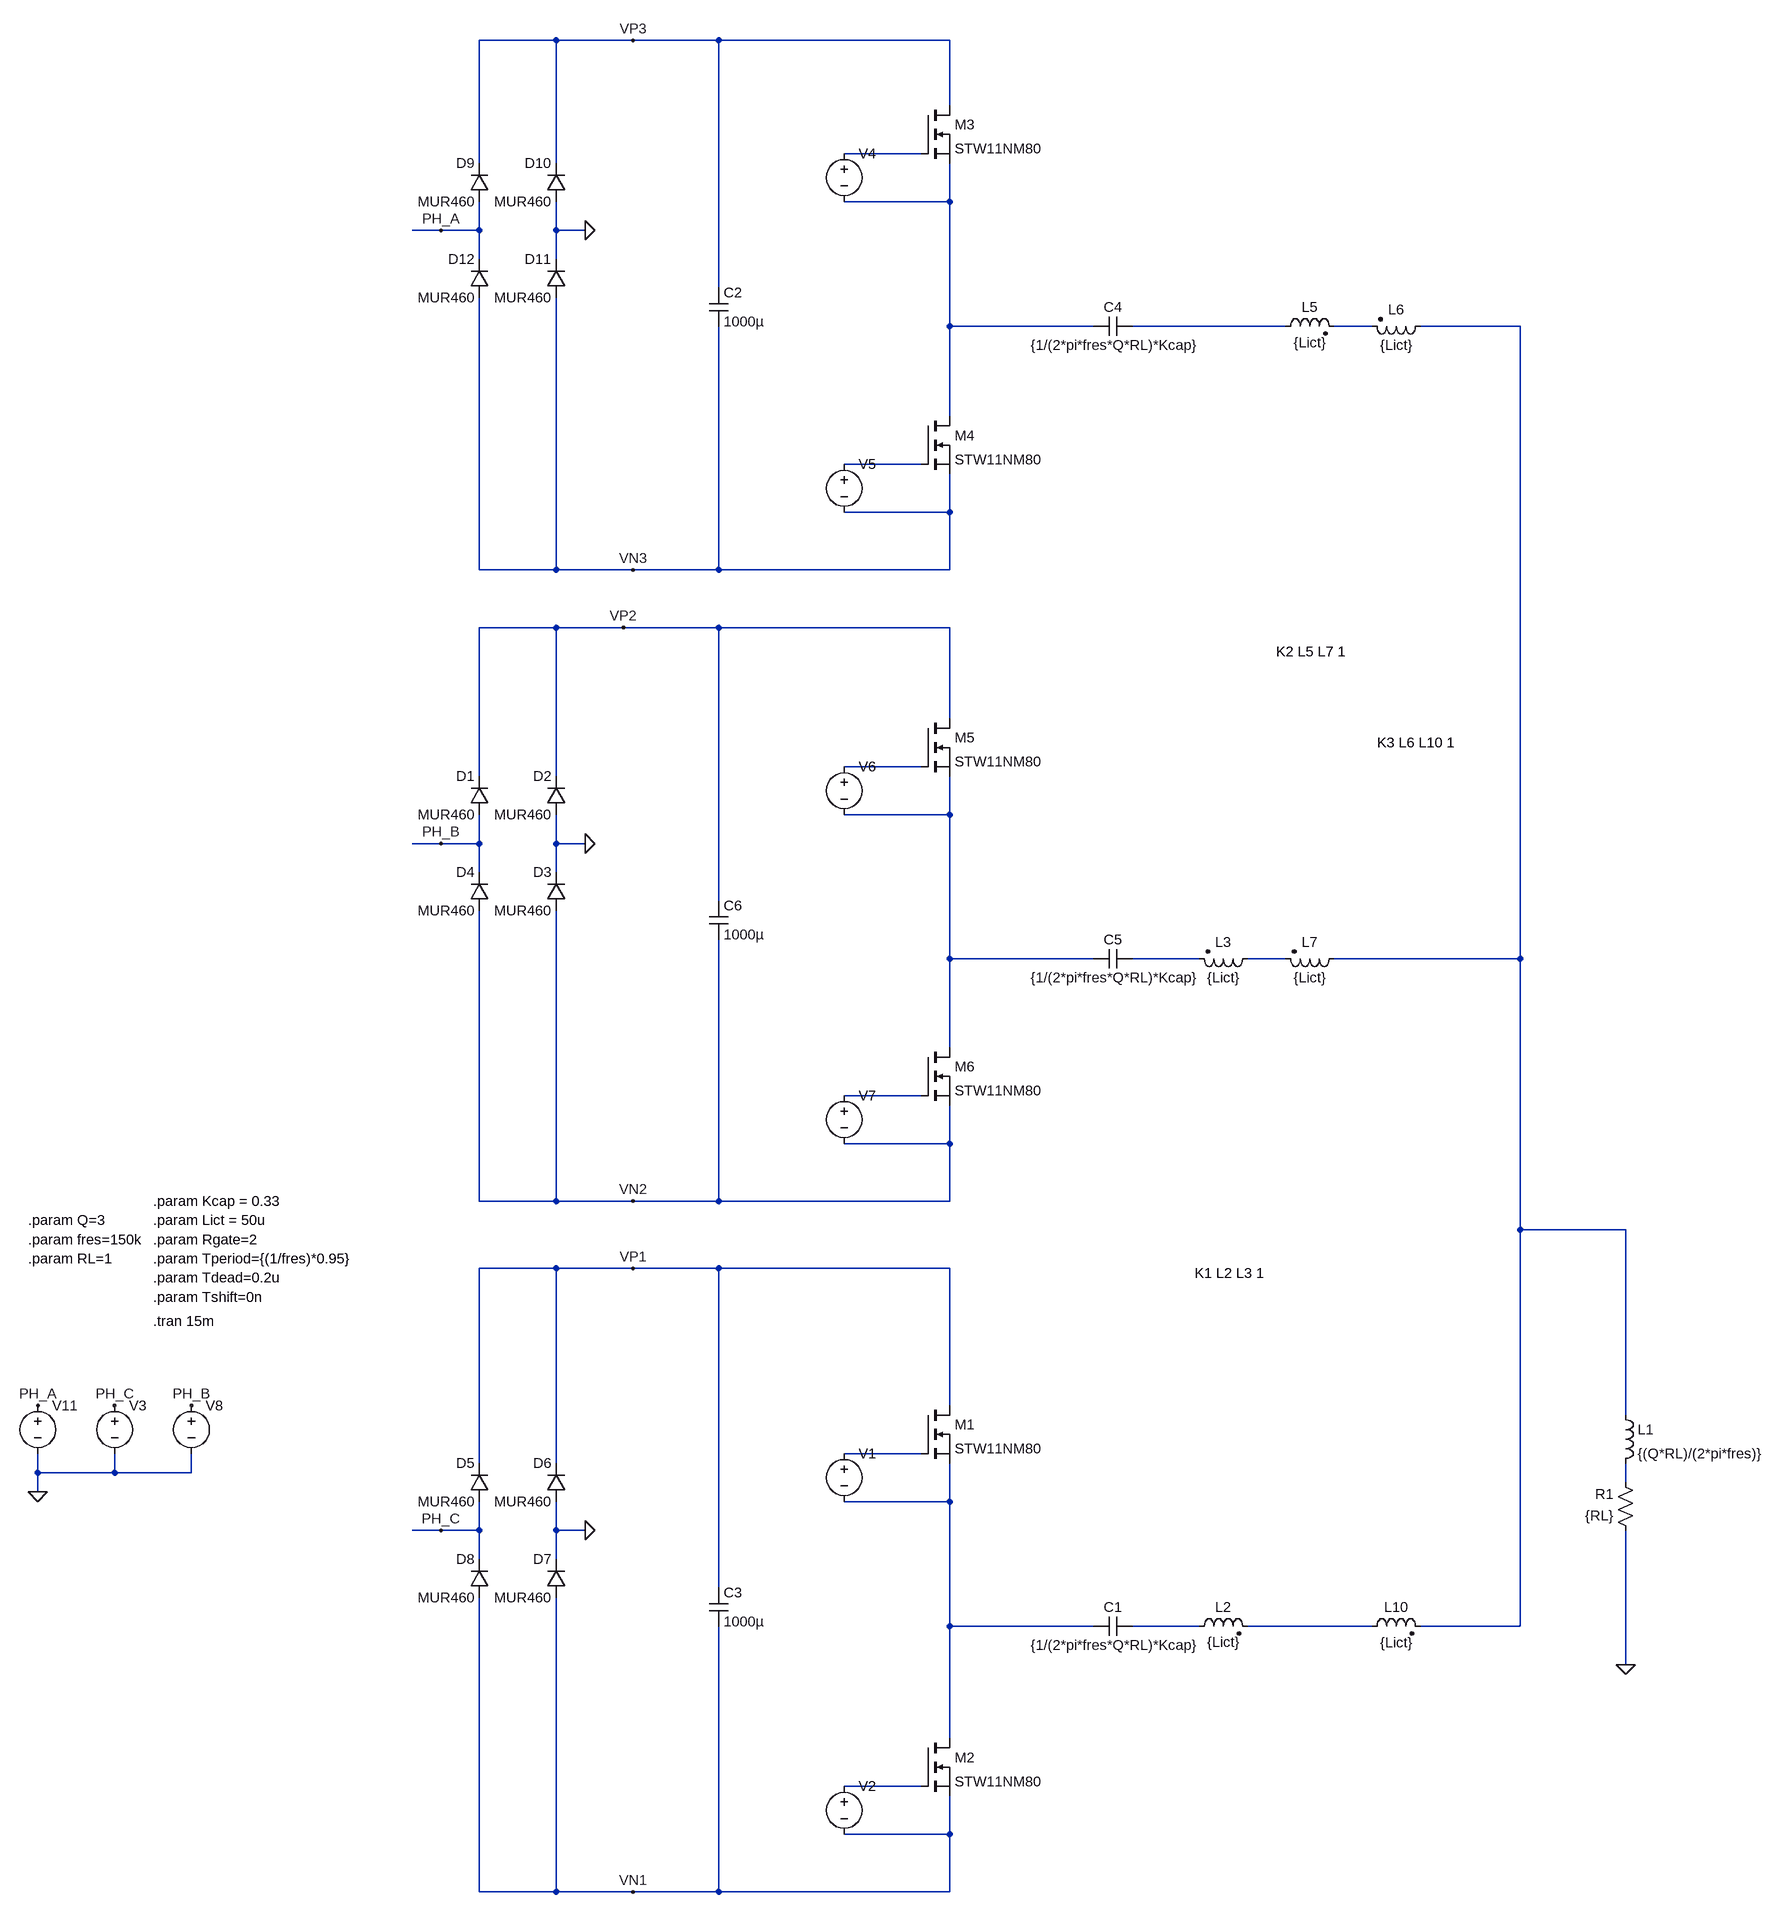
[diagram p0: schematic inv_sim15.asc]
inv_sim15.asc, the LTspice schematic file:
Version 4
SHEET 1 2752 948
WIRE -528 -2800 -656 -2800
WIRE -400 -2800 -528 -2800
WIRE -32 -2800 -400 -2800
WIRE 608 -2800 -32 -2800
WIRE 608 -2528 608 -2800
WIRE 560 -2448 432 -2448
WIRE -656 -2432 -656 -2800
WIRE -528 -2432 -528 -2800
WIRE 608 -2368 608 -2432
WIRE 608 -2368 432 -2368
WIRE -720 -2320 -768 -2320
WIRE -656 -2320 -656 -2368
WIRE -656 -2320 -720 -2320
WIRE -528 -2320 -528 -2368
WIRE -480 -2320 -528 -2320
WIRE -656 -2272 -656 -2320
WIRE -528 -2272 -528 -2320
WIRE -32 -2224 -32 -2800
WIRE 608 -2160 608 -2368
WIRE 848 -2160 608 -2160
WIRE 1168 -2160 912 -2160
WIRE 1312 -2160 1248 -2160
WIRE 1920 -2160 1392 -2160
WIRE 608 -1920 608 -2160
WIRE 560 -1840 432 -1840
WIRE 608 -1760 608 -1824
WIRE 608 -1760 432 -1760
WIRE -656 -1664 -656 -2208
WIRE -528 -1664 -528 -2208
WIRE -528 -1664 -656 -1664
WIRE -400 -1664 -528 -1664
WIRE -32 -1664 -32 -2160
WIRE -32 -1664 -400 -1664
WIRE 608 -1664 608 -1760
WIRE 608 -1664 -32 -1664
WIRE -528 -1568 -656 -1568
WIRE -416 -1568 -528 -1568
WIRE -32 -1568 -416 -1568
WIRE 608 -1568 -32 -1568
WIRE 608 -1296 608 -1568
WIRE 560 -1216 432 -1216
WIRE -656 -1200 -656 -1568
WIRE -528 -1200 -528 -1568
WIRE 608 -1136 608 -1200
WIRE 608 -1136 432 -1136
WIRE -720 -1088 -768 -1088
WIRE -656 -1088 -656 -1136
WIRE -656 -1088 -720 -1088
WIRE -528 -1088 -528 -1136
WIRE -480 -1088 -528 -1088
WIRE -656 -1040 -656 -1088
WIRE -528 -1040 -528 -1088
WIRE -32 -992 -32 -1568
WIRE 608 -896 608 -1136
WIRE 848 -896 608 -896
WIRE 1024 -896 912 -896
WIRE 1168 -896 1104 -896
WIRE 1920 -896 1920 -2160
WIRE 1920 -896 1248 -896
WIRE 608 -688 608 -896
WIRE 560 -608 432 -608
WIRE 608 -528 608 -592
WIRE 608 -528 432 -528
WIRE -656 -432 -656 -976
WIRE -528 -432 -528 -976
WIRE -528 -432 -656 -432
WIRE -400 -432 -528 -432
WIRE -32 -432 -32 -928
WIRE -32 -432 -400 -432
WIRE 608 -432 608 -528
WIRE 608 -432 -32 -432
WIRE 1920 -384 1920 -896
WIRE 2416 -384 1920 -384
WIRE -528 -320 -656 -320
WIRE -400 -320 -528 -320
WIRE -32 -320 -400 -320
WIRE 608 -320 -32 -320
WIRE 608 -48 608 -320
WIRE 2416 -32 2416 -384
WIRE 560 32 432 32
WIRE -656 48 -656 -320
WIRE -528 48 -528 -320
WIRE -1472 64 -1472 32
WIRE -1344 64 -1344 32
WIRE -1344 64 -1472 64
WIRE -1216 64 -1216 32
WIRE -1216 64 -1344 64
WIRE 2416 80 2416 48
WIRE -1472 96 -1472 64
WIRE 608 112 608 48
WIRE 608 112 432 112
WIRE -720 160 -768 160
WIRE -656 160 -656 112
WIRE -656 160 -720 160
WIRE -528 160 -528 112
WIRE -480 160 -528 160
WIRE -656 208 -656 160
WIRE -528 208 -528 160
WIRE -32 256 -32 -320
WIRE 608 320 608 112
WIRE 848 320 608 320
WIRE 1024 320 912 320
WIRE 1312 320 1104 320
WIRE 1920 320 1920 -384
WIRE 1920 320 1392 320
WIRE 2416 384 2416 160
WIRE 608 560 608 320
WIRE 560 640 432 640
WIRE 608 720 608 656
WIRE 608 720 432 720
WIRE -656 816 -656 272
WIRE -528 816 -528 272
WIRE -528 816 -656 816
WIRE -400 816 -528 816
WIRE -32 816 -32 320
WIRE -32 816 -400 816
WIRE 608 816 608 720
WIRE 608 816 -32 816
FLAG -416 -1568 VP2
FLAG -400 -432 VN2
FLAG -400 -320 VP1
FLAG 2416 384 0
FLAG -1472 96 0
FLAG -400 816 VN1
FLAG -1472 -48 PH_A
FLAG -480 -1088 0
FLAG -480 160 0
FLAG -720 160 PH_C
FLAG -720 -1088 PH_B
FLAG -400 -2800 VP3
FLAG -400 -1664 VN3
FLAG -480 -2320 0
FLAG -720 -2320 PH_A
FLAG -1216 -48 PH_B
FLAG -1344 -48 PH_C
SYMBOL nmos 560 -48 R0
SYMATTR InstName M1
SYMATTR Value STW11NM80
SYMBOL nmos 560 560 R0
SYMATTR InstName M2
SYMATTR Value STW11NM80
SYMBOL voltage 432 16 R0
WINDOW 3 24 96 Invisible 2
WINDOW 123 0 0 Left 2
SYMATTR Value PULSE(0 15 0 50n 50n {Tperiod / 2 - Tdead} {Tperiod})
SYMATTR InstName V1
SYMATTR SpiceLine Rser={Rgate}
SYMBOL voltage 432 624 R0
WINDOW 3 24 96 Invisible 2
WINDOW 123 0 0 Left 2
SYMATTR Value PULSE(0 15 {2 * Tperiod / 4} 50n 50n {Tperiod / 2 - Tdead} {Tperiod})
SYMATTR InstName V2
SYMATTR SpiceLine Rser={Rgate}
SYMBOL ind 2400 -48 R0
SYMATTR InstName L1
SYMATTR Value {(Q*RL)/(2*pi*fres)}
SYMBOL res 2432 176 R180
WINDOW 0 36 76 Left 2
WINDOW 3 36 40 Left 2
SYMATTR InstName R1
SYMATTR Value {RL}
SYMBOL cap -48 256 R0
SYMATTR InstName C3
SYMATTR Value 1000µ
SYMBOL nmos 560 -1296 R0
SYMATTR InstName M5
SYMATTR Value STW11NM80
SYMBOL nmos 560 -688 R0
SYMATTR InstName M6
SYMATTR Value STW11NM80
SYMBOL voltage 432 -1232 R0
WINDOW 3 24 96 Invisible 2
WINDOW 123 0 0 Left 2
SYMATTR Value PULSE(0 15 {Tshift} 50n 50n {Tperiod / 2 - Tdead} {Tperiod})
SYMATTR InstName V6
SYMATTR SpiceLine Rser={Rgate}
SYMBOL voltage 432 -624 R0
WINDOW 3 24 96 Invisible 2
WINDOW 123 0 0 Left 2
SYMATTR Value PULSE(0 15 {2 * Tperiod / 4 + Tshift} 50n 50n {Tperiod / 2 - Tdead} {Tperiod})
SYMATTR InstName V7
SYMATTR SpiceLine Rser={Rgate}
SYMBOL cap 912 -912 R90
WINDOW 0 0 32 VBottom 2
WINDOW 3 32 32 VTop 2
SYMATTR InstName C5
SYMATTR Value {1/(2*pi*fres*Q*RL)*Kcap}
SYMBOL cap -48 -992 R0
SYMATTR InstName C6
SYMATTR Value 1000µ
SYMBOL voltage -1472 -64 R0
WINDOW 123 0 0 Left 2
WINDOW 39 0 0 Left 2
WINDOW 3 24 96 Invisible 2
SYMATTR Value SINE(0 170 60 0 0 0)
SYMATTR InstName V11
SYMBOL ind2 1120 -912 R90
WINDOW 0 4 56 VBottom 2
WINDOW 3 32 56 VTop 2
SYMATTR InstName L3
SYMATTR Value {Lict}
SYMATTR Type ind
SYMBOL ind2 1008 336 R270
WINDOW 0 32 56 VTop 2
WINDOW 3 5 56 VBottom 2
SYMATTR InstName L2
SYMATTR Value {Lict}
SYMATTR Type ind
SYMBOL cap 912 304 R90
WINDOW 0 0 32 VBottom 2
WINDOW 3 32 32 VTop 2
SYMATTR InstName C1
SYMATTR Value {1/(2*pi*fres*Q*RL)*Kcap}
SYMBOL voltage -1344 -64 R0
WINDOW 3 24 96 Invisible 2
WINDOW 123 0 0 Left 2
WINDOW 39 0 0 Left 2
SYMATTR Value SINE(0 170 60 0 0 240)
SYMATTR InstName V3
SYMBOL diode -640 -1136 R180
WINDOW 0 24 64 Left 2
WINDOW 3 24 0 Left 2
SYMATTR InstName D1
SYMATTR Value MUR460
SYMBOL diode -512 -1136 R180
WINDOW 0 24 64 Left 2
WINDOW 3 24 0 Left 2
SYMATTR InstName D2
SYMATTR Value MUR460
SYMBOL diode -512 -976 R180
WINDOW 0 24 64 Left 2
WINDOW 3 24 0 Left 2
SYMATTR InstName D3
SYMATTR Value MUR460
SYMBOL diode -640 -976 R180
WINDOW 0 24 64 Left 2
WINDOW 3 24 0 Left 2
SYMATTR InstName D4
SYMATTR Value MUR460
SYMBOL diode -640 112 R180
WINDOW 0 24 64 Left 2
WINDOW 3 24 0 Left 2
SYMATTR InstName D5
SYMATTR Value MUR460
SYMBOL diode -512 112 R180
WINDOW 0 24 64 Left 2
WINDOW 3 24 0 Left 2
SYMATTR InstName D6
SYMATTR Value MUR460
SYMBOL diode -512 272 R180
WINDOW 0 24 64 Left 2
WINDOW 3 24 0 Left 2
SYMATTR InstName D7
SYMATTR Value MUR460
SYMBOL diode -640 272 R180
WINDOW 0 24 64 Left 2
WINDOW 3 24 0 Left 2
SYMATTR InstName D8
SYMATTR Value MUR460
SYMBOL nmos 560 -2528 R0
SYMATTR InstName M3
SYMATTR Value STW11NM80
SYMBOL nmos 560 -1920 R0
SYMATTR InstName M4
SYMATTR Value STW11NM80
SYMBOL voltage 432 -2464 R0
WINDOW 3 24 96 Invisible 2
WINDOW 123 0 0 Left 2
SYMATTR Value PULSE(0 15 0 50n 50n {Tperiod / 2 - Tdead} {Tperiod})
SYMATTR InstName V4
SYMATTR SpiceLine Rser={Rgate}
SYMBOL voltage 432 -1856 R0
WINDOW 3 24 96 Invisible 2
WINDOW 123 0 0 Left 2
SYMATTR Value PULSE(0 15 {2 * Tperiod / 4} 50n 50n {Tperiod / 2 - Tdead} {Tperiod})
SYMATTR InstName V5
SYMATTR SpiceLine Rser={Rgate}
SYMBOL cap -48 -2224 R0
SYMATTR InstName C2
SYMATTR Value 1000µ
SYMBOL diode -640 -2368 R180
WINDOW 0 24 64 Left 2
WINDOW 3 24 0 Left 2
SYMATTR InstName D9
SYMATTR Value MUR460
SYMBOL diode -512 -2368 R180
WINDOW 0 24 64 Left 2
WINDOW 3 24 0 Left 2
SYMATTR InstName D10
SYMATTR Value MUR460
SYMBOL diode -512 -2208 R180
WINDOW 0 24 64 Left 2
WINDOW 3 24 0 Left 2
SYMATTR InstName D11
SYMATTR Value MUR460
SYMBOL diode -640 -2208 R180
WINDOW 0 24 64 Left 2
WINDOW 3 24 0 Left 2
SYMATTR InstName D12
SYMATTR Value MUR460
SYMBOL voltage -1216 -64 R0
WINDOW 3 24 96 Invisible 2
WINDOW 123 0 0 Left 2
WINDOW 39 0 0 Left 2
SYMATTR Value SINE(0 170 60 0 0 120)
SYMATTR InstName V8
SYMBOL cap 912 -2176 R90
WINDOW 0 0 32 VBottom 2
WINDOW 3 32 32 VTop 2
SYMATTR InstName C4
SYMATTR Value {1/(2*pi*fres*Q*RL)*Kcap}
SYMBOL ind2 1152 -2144 R270
WINDOW 0 32 56 VTop 2
WINDOW 3 4 56 VBottom 2
SYMATTR InstName L5
SYMATTR Value {Lict}
SYMATTR Type ind
SYMBOL ind2 1408 -2176 R90
WINDOW 0 4 56 VBottom 2
WINDOW 3 32 56 VTop 2
SYMATTR InstName L6
SYMATTR Value {Lict}
SYMATTR Type ind
SYMBOL ind2 1264 -912 R90
WINDOW 0 4 56 VBottom 2
WINDOW 3 32 56 VTop 2
SYMATTR InstName L7
SYMATTR Value {Lict}
SYMATTR Type ind
SYMBOL ind2 1296 336 R270
WINDOW 0 32 56 VTop 2
WINDOW 3 4 56 VBottom 2
SYMATTR InstName L10
SYMATTR Value {Lict}
SYMATTR Type ind
TEXT -1280 -368 Left 2 !.param Rgate=2
TEXT -1280 -232 Left 2 !.tran 15m
TEXT -1280 -336 Left 2 !.param Tperiod={(1/fres)*0.95}
TEXT -1280 -304 Left 2 !.param Tdead=0.2u
TEXT -1488 -400 Left 2 !.param Q=3
TEXT -1488 -368 Left 2 !.param fres=150k
TEXT -1488 -336 Left 2 !.param RL=1
TEXT -1280 -272 Left 2 !.param Tshift=0n
TEXT -1280 -400 Left 2 !.param Lict = 50u
TEXT 1016 -312 Left 2 !K1 L2 L3 1
TEXT -1280 -432 Left 2 !.param Kcap = 0.33
TEXT 1152 -1528 Left 2 !K2 L5 L7 1
TEXT 1320 -1256 Left 2 !K3 L6 L10 1

The netlist it stands for:
* inv_sim15.asc
M1 VP1 N012 N014 N014 STW11NM80
M2 N014 N017 VN1 VN1 STW11NM80
V1 N012 N014 PULSE(0 15 0 50n 50n {Tperiod / 2 - Tdead} {Tperiod}) Rser={Rgate}
V2 N017 VN1 PULSE(0 15 {2 * Tperiod / 4} 50n 50n {Tperiod / 2 - Tdead} {Tperiod}) Rser={Rgate}
L1 N005 N013 {(Q*RL)/(2*pi*fres)}
R1 0 N013 {RL}
C3 VP1 VN1 1000µ
M5 VP2 N007 N008 N008 STW11NM80
M6 N008 N011 VN2 VN2 STW11NM80
V6 N007 N008 PULSE(0 15 {Tshift} 50n 50n {Tperiod / 2 - Tdead} {Tperiod}) Rser={Rgate}
V7 N011 VN2 PULSE(0 15 {2 * Tperiod / 4 + Tshift} 50n 50n {Tperiod / 2 - Tdead} {Tperiod}) Rser={Rgate}
C5 N009 N008 {1/(2*pi*fres*Q*RL)*Kcap}
C6 VP2 VN2 1000µ
V11 PH_A 0 SINE(0 170 60 0 0 0)
L3 N010 N009 {Lict}
L2 N015 N016 {Lict}
C1 N015 N014 {1/(2*pi*fres*Q*RL)*Kcap}
V3 PH_C 0 SINE(0 170 60 0 0 240)
D1 PH_B VP2 MUR460
D2 0 VP2 MUR460
D3 VN2 0 MUR460
D4 VN2 PH_B MUR460
D5 PH_C VP1 MUR460
D6 0 VP1 MUR460
D7 VN1 0 MUR460
D8 VN1 PH_C MUR460
M3 VP3 N001 N002 N002 STW11NM80
M4 N002 N006 VN3 VN3 STW11NM80
V4 N001 N002 PULSE(0 15 0 50n 50n {Tperiod / 2 - Tdead} {Tperiod}) Rser={Rgate}
V5 N006 VN3 PULSE(0 15 {2 * Tperiod / 4} 50n 50n {Tperiod / 2 - Tdead} {Tperiod}) Rser={Rgate}
C2 VP3 VN3 1000µ
D9 PH_A VP3 MUR460
D10 0 VP3 MUR460
D11 VN3 0 MUR460
D12 VN3 PH_A MUR460
V8 PH_B 0 SINE(0 170 60 0 0 120)
C4 N003 N002 {1/(2*pi*fres*Q*RL)*Kcap}
L5 N003 N004 {Lict}
L6 N005 N004 {Lict}
L7 N005 N010 {Lict}
L10 N016 N005 {Lict}
.model D D
.lib standard.dio
.model NMOS NMOS
.model PMOS PMOS
.lib standard.mos
.param Rgate=2
.tran 15m
.param Tperiod={(1/fres)*0.95}
.param Tdead=0.2u
.param Q=3
.param fres=150k
.param RL=1
.param Tshift=0n
.param Lict = 50u
K1 L2 L3 1
.param Kcap = 0.33
K2 L5 L7 1
K3 L6 L10 1
.backanno
.end